# EAGLE design Keyboard40 (EAGLE 9.3.0)

## Sheet 1 of 2
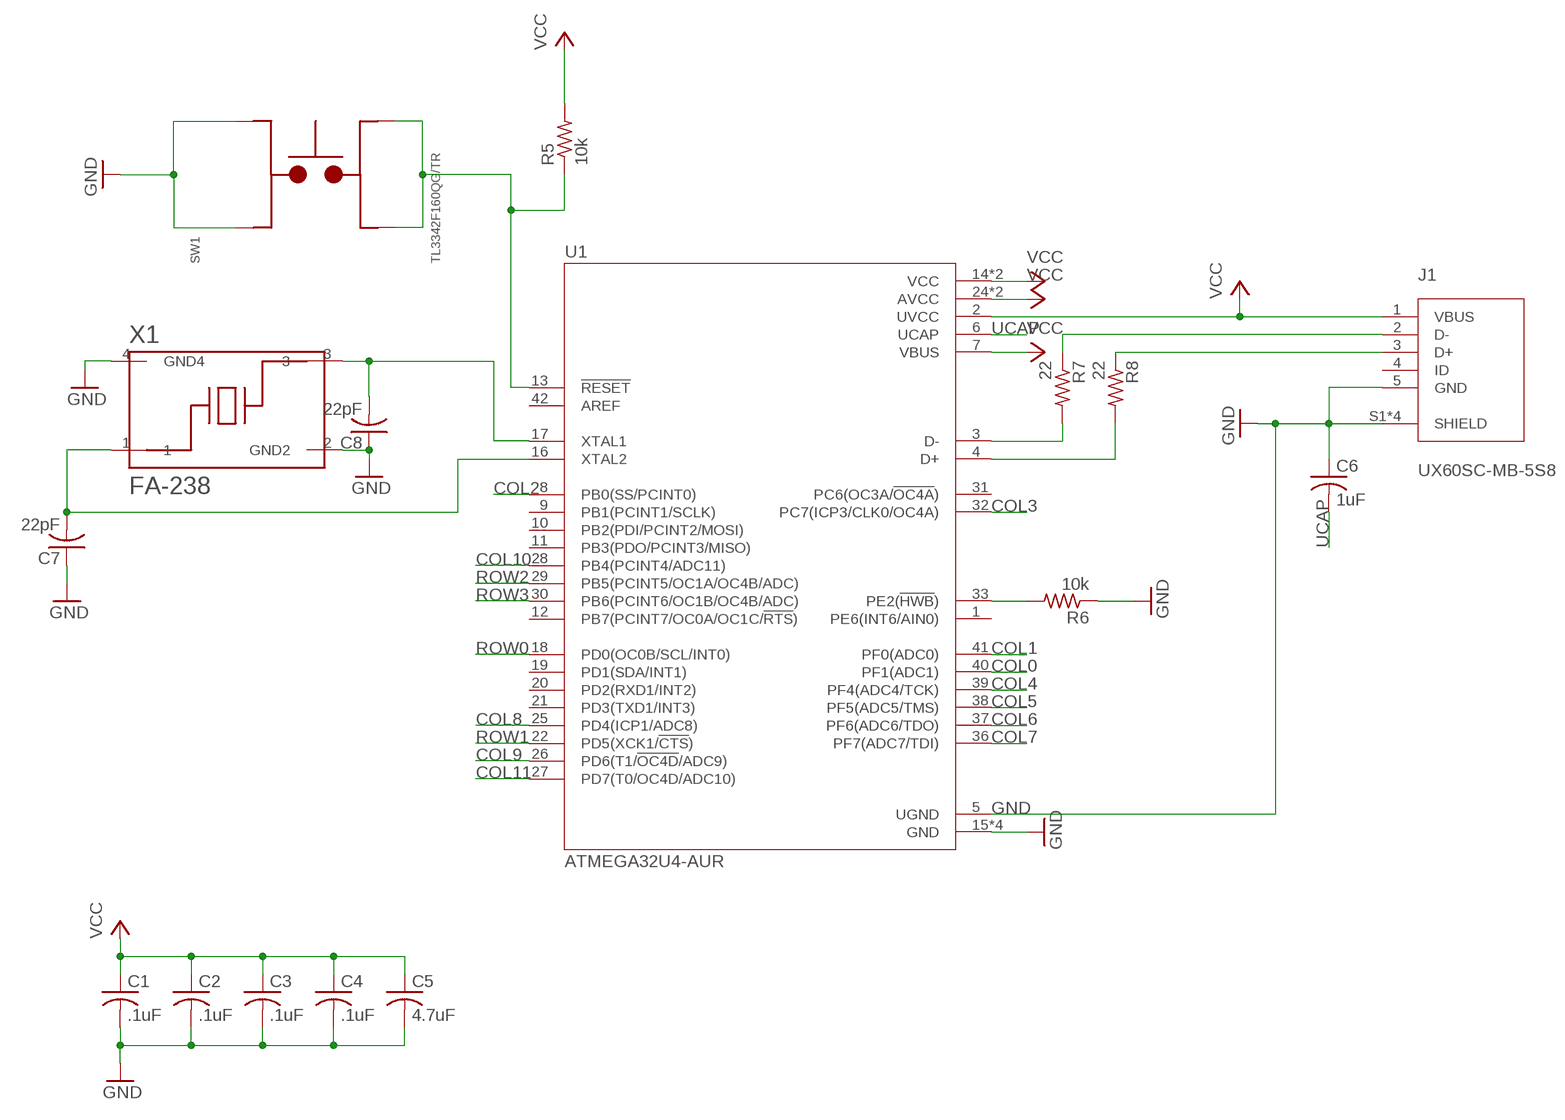
[diagram p0: schematic, sheet 1]

### Parts
C1  .1uF  C-USC0805  [C0805]
C2  .1uF  C-USC0805  [C0805]
C3  .1uF  C-USC0805  [C0805]
C4  .1uF  C-USC0805  [C0805]
C5  4.7uF  C-USC0805  [C0805]
C6  1uF  C-USC0805  [C0805]
C7  22pF  C-USC0805  [C0805]
C8  22pF  C-USC0805  [C0805]
J1  UX60SC-MB-5S8  [HIROSE_UX60SC-MB-5S8]
R5  10k  R-US_R0805  [R0805]
R6  10k  R-US_R0805  [R0805]
R7  22  R-US_R0805  [R0805]
R8  22  R-US_R0805  [R0805]
SW1  TL3342F160QG/TR  [SW_TL3342F160QG/TR]
U1  ATMEGA32U4-AUR  [QFP80P1200X1200X120-44N]
X1  FA-238  [OSCCC320X250X70-4N]

### Nets
COL0: U1.40(PF1(ADC1)) ; also sheet 2
COL1: U1.41(PF0(ADC0)) ; also sheet 2
COL2: U1.8(PB0(SS/PCINT0)) ; also sheet 2
COL3: U1.32(PC7(ICP3/CLK0/OC4A)) ; also sheet 2
COL4: U1.39(PF4(ADC4/TCK)) ; also sheet 2
COL5: U1.38(PF5(ADC5/TMS)) ; also sheet 2
COL6: U1.37(PF6(ADC6/TDO)) ; also sheet 2
COL7: U1.36(PF7(ADC7/TDI)) ; also sheet 2
COL8: U1.25(PD4(ICP1/ADC8)) ; also sheet 2
COL9: U1.26(PD6(T1/!OC4D!/ADC9)) ; also sheet 2
COL10: U1.28(PB4(PCINT4/ADC11)) ; also sheet 2
COL11: U1.27(PD7(T0/OC4D/ADC10)) ; also sheet 2
GND: C1.2 C2.2 C3.2 C4.2 C5.2 C6.1 C7.1 C8.1 J1.5(GND) J1.S1(SHIELD) J1.S2(SHIELD) J1.S3(SHIELD) J1.S4(SHIELD) R6.1 SW1.3 SW1.4 U1.5(UGND) U1.15(GND) U1.23(GND) U1.35(GND) U1.43(GND) X1.2(GND2) X1.4(GND4)
N$7: C8.2 U1.17(XTAL1) X1.3
N$8: C7.2 U1.16(XTAL2) X1.1
N$9: R5.1 SW1.1 SW1.2 U1.13(!RESET)
N$10: R6.2 U1.33(PE2(!HWB!))
N$14: R7.2 U1.3(D-)
N$15: J1.2(D-) R7.1
N$16: R8.2 U1.4(D+)
N$17: J1.3(D+) R8.1
ROW0: U1.18(PD0(OC0B/SCL/INT0)) ; also sheet 2
ROW1: U1.22(PD5(XCK1/!CTS!)) ; also sheet 2
ROW2: U1.29(PB5(PCINT5/OC1A/OC4B/ADC)) ; also sheet 2
ROW3: U1.30(PB6(PCINT6/OC1B/OC4B/ADC)) ; also sheet 2
UCAP: C6.2 U1.6(UCAP)
VCC: C1.1 C2.1 C3.1 C4.1 C5.1 J1.1(VBUS) R5.2 U1.2(UVCC) U1.7(VBUS) U1.14(VCC) U1.24(AVCC) U1.34(VCC) U1.44(AVCC)
Unconnected: J1.4(ID) U1.1(PE6(INT6/AIN0)) U1.9(PB1(PCINT1/SCLK)) U1.10(PB2(PDI/PCINT2/MOSI)) U1.11(PB3(PDO/PCINT3/MISO)) U1.12(PB7(PCINT7/OC0A/OC1C/!RTS!)) U1.19(PD1(SDA/INT1)) U1.20(PD2(RXD1/INT2)) U1.21(PD3(TXD1/INT3)) U1.31(PC6(OC3A/!OC4A!)) U1.42(AREF)

## Sheet 2 of 2
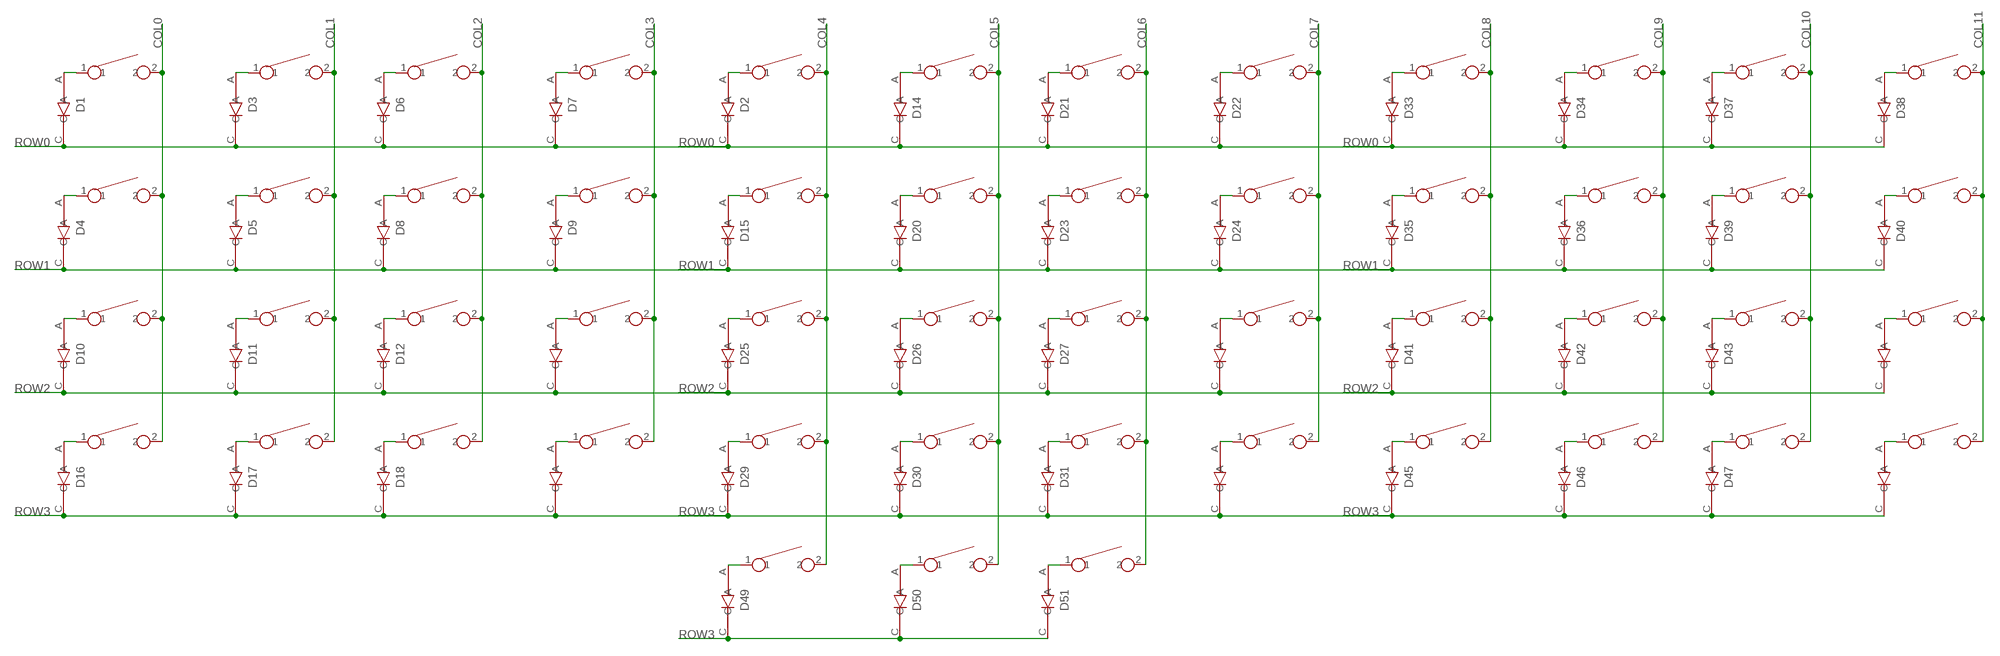
[diagram p1: schematic, sheet 2]

### Parts
D1  BAV21W-7-F  [SOD3715X135N]
D2  BAV21W-7-F  [SOD3715X135N]
D3  BAV21W-7-F  [SOD3715X135N]
D4  BAV21W-7-F  [SOD3715X135N]
D5  BAV21W-7-F  [SOD3715X135N]
D6  BAV21W-7-F  [SOD3715X135N]
D7  BAV21W-7-F  [SOD3715X135N]
D8  BAV21W-7-F  [SOD3715X135N]
D9  BAV21W-7-F  [SOD3715X135N]
D10  BAV21W-7-F  [SOD3715X135N]
D11  BAV21W-7-F  [SOD3715X135N]
D12  BAV21W-7-F  [SOD3715X135N]
D13  BAV21W-7-F  [SOD3715X135N]
D14  BAV21W-7-F  [SOD3715X135N]
D15  BAV21W-7-F  [SOD3715X135N]
D16  BAV21W-7-F  [SOD3715X135N]
D17  BAV21W-7-F  [SOD3715X135N]
D18  BAV21W-7-F  [SOD3715X135N]
D19  BAV21W-7-F  [SOD3715X135N]
D20  BAV21W-7-F  [SOD3715X135N]
D21  BAV21W-7-F  [SOD3715X135N]
D22  BAV21W-7-F  [SOD3715X135N]
D23  BAV21W-7-F  [SOD3715X135N]
D24  BAV21W-7-F  [SOD3715X135N]
D25  BAV21W-7-F  [SOD3715X135N]
D26  BAV21W-7-F  [SOD3715X135N]
D27  BAV21W-7-F  [SOD3715X135N]
D28  BAV21W-7-F  [SOD3715X135N]
D29  BAV21W-7-F  [SOD3715X135N]
D30  BAV21W-7-F  [SOD3715X135N]
D31  BAV21W-7-F  [SOD3715X135N]
D32  BAV21W-7-F  [SOD3715X135N]
D33  BAV21W-7-F  [SOD3715X135N]
D34  BAV21W-7-F  [SOD3715X135N]
D35  BAV21W-7-F  [SOD3715X135N]
D36  BAV21W-7-F  [SOD3715X135N]
D37  BAV21W-7-F  [SOD3715X135N]
D38  BAV21W-7-F  [SOD3715X135N]
D39  BAV21W-7-F  [SOD3715X135N]
D40  BAV21W-7-F  [SOD3715X135N]
D41  BAV21W-7-F  [SOD3715X135N]
D42  BAV21W-7-F  [SOD3715X135N]
D43  BAV21W-7-F  [SOD3715X135N]
D44  BAV21W-7-F  [SOD3715X135N]
D45  BAV21W-7-F  [SOD3715X135N]
D46  BAV21W-7-F  [SOD3715X135N]
D47  BAV21W-7-F  [SOD3715X135N]
D48  BAV21W-7-F  [SOD3715X135N]
D49  BAV21W-7-F  [SOD3715X135N]
D50  BAV21W-7-F  [SOD3715X135N]
D51  BAV21W-7-F  [SOD3715X135N]
U$1  CHERRY_MXCHERRY_MX_PLATE  [CHERRY_MX_PLATE]
U$2  CHERRY_MXCHERRY_MX_PLATE  [CHERRY_MX_PLATE]
U$3  CHERRY_MXCHERRY_MX_PLATE  [CHERRY_MX_PLATE]
U$4  CHERRY_MXCHERRY_MX_PLATE  [CHERRY_MX_PLATE]
U$5  CHERRY_MXCHERRY_MX_PLATE  [CHERRY_MX_PLATE]
U$6  CHERRY_MXCHERRY_MX_PLATE  [CHERRY_MX_PLATE]
U$7  CHERRY_MXCHERRY_MX_PLATE  [CHERRY_MX_PLATE]
U$8  CHERRY_MXCHERRY_MX_PLATE  [CHERRY_MX_PLATE]
U$9  CHERRY_MXCHERRY_MX_PLATE  [CHERRY_MX_PLATE]
U$10  CHERRY_MXCHERRY_MX_PLATE  [CHERRY_MX_PLATE]
U$11  CHERRY_MXCHERRY_MX_PLATE  [CHERRY_MX_PLATE]
U$12  CHERRY_MXCHERRY_MX_PLATE  [CHERRY_MX_PLATE]
U$13  CHERRY_MXCHERRY_MX_1_2_PLATE  [CHERRY_MX_1_2_PLATE]
U$14  CHERRY_MXCHERRY_MX_1_2_PLATE  [CHERRY_MX_1_2_PLATE]
U$15  CHERRY_MXCHERRY_MX_1_2_PLATE  [CHERRY_MX_1_2_PLATE]
U$16  CHERRY_MXCHERRY_MX_PLATE  [CHERRY_MX_PLATE]
U$17  CHERRY_MXCHERRY_MX_PLATE  [CHERRY_MX_PLATE]
U$18  CHERRY_MXCHERRY_MX_PLATE  [CHERRY_MX_PLATE]
U$19  CHERRY_MXCHERRY_MX_PLATE  [CHERRY_MX_PLATE]
U$20  CHERRY_MXCHERRY_MX_PLATE  [CHERRY_MX_PLATE]
U$21  CHERRY_MXCHERRY_MX_PLATE  [CHERRY_MX_PLATE]
U$22  CHERRY_MXCHERRY_MX_PLATE  [CHERRY_MX_PLATE]
U$23  CHERRY_MXCHERRY_MX_PLATE  [CHERRY_MX_PLATE]
U$24  CHERRY_MXCHERRY_MX_PLATE  [CHERRY_MX_PLATE]
U$25  CHERRY_MXCHERRY_MX_PLATE  [CHERRY_MX_PLATE]
U$26  CHERRY_MXCHERRY_MX_PLATE  [CHERRY_MX_PLATE]
U$27  CHERRY_MXCHERRY_MX_PLATE  [CHERRY_MX_PLATE]
U$28  CHERRY_MXCHERRY_MX_PLATE  [CHERRY_MX_PLATE]
U$29  CHERRY_MXCHERRY_MX_PLATE  [CHERRY_MX_PLATE]
U$30  CHERRY_MXCHERRY_MX_PLATE  [CHERRY_MX_PLATE]
U$31  CHERRY_MXCHERRY_MX_PLATE  [CHERRY_MX_PLATE]
U$32  CHERRY_MXCHERRY_MX_PLATE  [CHERRY_MX_PLATE]
U$33  CHERRY_MXCHERRY_MX_PLATE  [CHERRY_MX_PLATE]
U$34  CHERRY_MXCHERRY_MX_PLATE  [CHERRY_MX_PLATE]
U$35  CHERRY_MXCHERRY_MX_PLATE  [CHERRY_MX_PLATE]
U$36  CHERRY_MXCHERRY_MX_PLATE  [CHERRY_MX_PLATE]
U$37  CHERRY_MXCHERRY_MX_PLATE  [CHERRY_MX_PLATE]
U$38  CHERRY_MXCHERRY_MX_PLATE  [CHERRY_MX_PLATE]
U$39  CHERRY_MXCHERRY_MX_PLATE  [CHERRY_MX_PLATE]
U$40  CHERRY_MXCHERRY_MX_PLATE  [CHERRY_MX_PLATE]
U$41  CHERRY_MXCHERRY_MX_PLATE  [CHERRY_MX_PLATE]
U$42  CHERRY_MXCHERRY_MX_PLATE  [CHERRY_MX_PLATE]
U$43  CHERRY_MXCHERRY_MX_PLATE  [CHERRY_MX_PLATE]
U$44  CHERRY_MXCHERRY_MX_PLATE  [CHERRY_MX_PLATE]
U$45  CHERRY_MXCHERRY_MX_PLATE  [CHERRY_MX_PLATE]
U$46  CHERRY_MXCHERRY_MX_PLATE  [CHERRY_MX_PLATE]
U$47  CHERRY_MXCHERRY_MX_PLATE  [CHERRY_MX_PLATE]
U$48  CHERRY_MXCHERRY_MX_PLATE  [CHERRY_MX_PLATE]
U$49  CHERRY_MXCHERRY_MX_PLATE  [CHERRY_MX_PLATE]
U$50  CHERRY_MXCHERRY_MX_PLATE  [CHERRY_MX_PLATE]
U$51  CHERRY_MXCHERRY_MX_PLATE  [CHERRY_MX_PLATE]

### Nets
COL0: U$1.2 U$2.2 U$3.2 U$17.2 ; also sheet 1
COL1: U$4.2 U$5.2 U$6.2 U$18.2 ; also sheet 1
COL2: U$7.2 U$8.2 U$9.2 U$19.2 ; also sheet 1
COL3: U$10.2 U$11.2 U$12.2 U$16.2 ; also sheet 1
COL4: U$13.2 U$22.2 U$23.2 U$24.2 U$36.2 ; also sheet 1
COL5: U$14.2 U$25.2 U$26.2 U$27.2 U$37.2 ; also sheet 1
COL6: U$15.2 U$28.2 U$29.2 U$30.2 U$38.2 ; also sheet 1
COL7: U$20.2 U$21.2 U$31.2 U$35.2 ; also sheet 1
COL8: U$34.2 U$39.2 U$40.2 U$49.2 ; also sheet 1
COL9: U$41.2 U$42.2 U$43.2 U$50.2 ; also sheet 1
COL10: U$44.2 U$45.2 U$46.2 U$51.2 ; also sheet 1
COL11: U$32.2 U$33.2 U$47.2 U$48.2 ; also sheet 1
N$1: D9.A U$10.1
N$2: D5.A U$5.1
N$3: D7.A U$12.1
N$4: D20.A U$26.1
N$5: D14.A U$25.1
N$6: D3.A U$4.1
N$11: D11.A U$6.1
N$12: D13.A U$11.1
N$18: D16.A U$17.1
N$19: D19.A U$16.1
N$20: D49.A U$13.1
N$21: D17.A U$18.1
N$22: D24.A U$20.1
N$23: D22.A U$31.1
N$24: D26.A U$27.1
N$25: D28.A U$21.1
N$26: D25.A U$24.1
N$27: D2.A U$22.1
N$28: D15.A U$23.1
N$29: D21.A U$28.1
N$30: D23.A U$29.1
N$31: D27.A U$30.1
N$32: D36.A U$42.1
N$33: D6.A U$7.1
N$34: D32.A U$35.1
N$35: D8.A U$8.1
N$36: D12.A U$9.1
N$37: D10.A U$3.1
N$38: D1.A U$1.1
N$39: D4.A U$2.1
N$40: D30.A U$37.1
N$41: D31.A U$38.1
N$42: D29.A U$36.1
N$43: D34.A U$41.1
N$44: D40.A U$32.1
N$45: D38.A U$47.1
N$46: D42.A U$43.1
N$47: D44.A U$33.1
N$48: D41.A U$40.1
N$49: D33.A U$34.1
N$50: D35.A U$39.1
N$51: D37.A U$44.1
N$52: D39.A U$45.1
N$53: D43.A U$46.1
N$54: D48.A U$48.1
N$55: D47.A U$51.1
N$56: D45.A U$49.1
N$57: D46.A U$50.1
N$58: D18.A U$19.1
N$59: D50.A U$14.1
N$60: D51.A U$15.1
ROW0: D1.C D2.C D3.C D6.C D7.C D14.C D21.C D22.C D33.C D34.C D37.C D38.C ; also sheet 1
ROW1: D4.C D5.C D8.C D9.C D15.C D20.C D23.C D24.C D35.C D36.C D39.C D40.C ; also sheet 1
ROW2: D10.C D11.C D12.C D13.C D25.C D26.C D27.C D28.C D41.C D42.C D43.C D44.C ; also sheet 1
ROW3: D16.C D17.C D18.C D19.C D29.C D30.C D31.C D32.C D45.C D46.C D47.C D48.C D49.C D50.C D51.C ; also sheet 1

## Library data of the parts
C1-C8 = rcl:C-US: CAPACITOR, American symbol; SPICEPREFIX: C
D1-D51 = BAV21W-7-F:BAV21W-7-F: SURFACE MOUNT SWITCHING DIODE; DESCRIPTION: DIODE, SWITCH, 200V, 0.25W, SOD123; Diode Type: Switching; Forward Current If_AV_; DIGI-KEY_PART_NUMBER: BAV21W-FDICT-ND; DIGI-KEY_PURCHASE_URL: https://www.digikey.com/product-detail/en/diodes-incorporated/BAV21W-7-F/BAV21W-FDICT-ND/717830?utm_source=snapeda&utm_medium=aggregator&utm_campaign=symbol; MF: Diodes Inc.; MP: BAV21W-7-F; PACKAGE: SOD-123 Diodes Inc.
J1 = UX60SC-MB-5S8:UX60SC-MB-5S8: Conn Mini USB 2.0 Type B RCP 5 POS 0.8mm Solder RA SMD 5 Terminal 1 Port Embossed T/R; AVAILABILITY: Unavailable; DESCRIPTION: Conn Mini USB 2.0 Type B RCP 5 POS 0.8mm Solder RA SMD 5 Terminal 1 Port Embossed T/R; MF: Hirose; MP: UX60SC-MB-5S8; PACKAGE: None; PRICE: None
R5-R8 = rcl:R-US_: RESISTOR, American symbol; SPICEPREFIX: R
SW1 = TL3342F160QG_TR:TL3342F160QG/TR: TL3342 Series SPST 1.6 N Round Button Gull Wing Surface Mount Tactile Switch; AVAILABILITY: Unavailable; DESCRIPTION: Switch Tactile Spst-No 0.05a 12v; MF: E-Switch; MP: TL3342F160QG/TR; PACKAGE: FakePackage u; PRICE: None
U1 = ATMEGA32U4-AUR:ATMEGA32U4-AUR: ATmega Series 16 MHz 32 KB Flash 2.5 KB SRAM 8-Bit Microcontroller - TQFP-44; AVAILABILITY: Unavailable; DESCRIPTION: ATmega Series 16 MHz 32 KB Flash 2.5 KB SRAM 8-Bit Microcontroller - TQFP-44; MF: Microchip; MP: ATMEGA32U4-AUR; PACKAGE: TQFP-44 Microchip; PRICE: None
U$1-U$51 = CHERRY_MX:CHERRY_MX
X1 = FA-238:FA-238: Crystal 24.0000mhz 18pf Smd; AVAILABILITY: Unavailable; MF: EPSON; MP: FA-238; PACKAGE: SMD-4 Epson; PRICE: None

## Net classes
0 default: width 0.203 mm

## Board
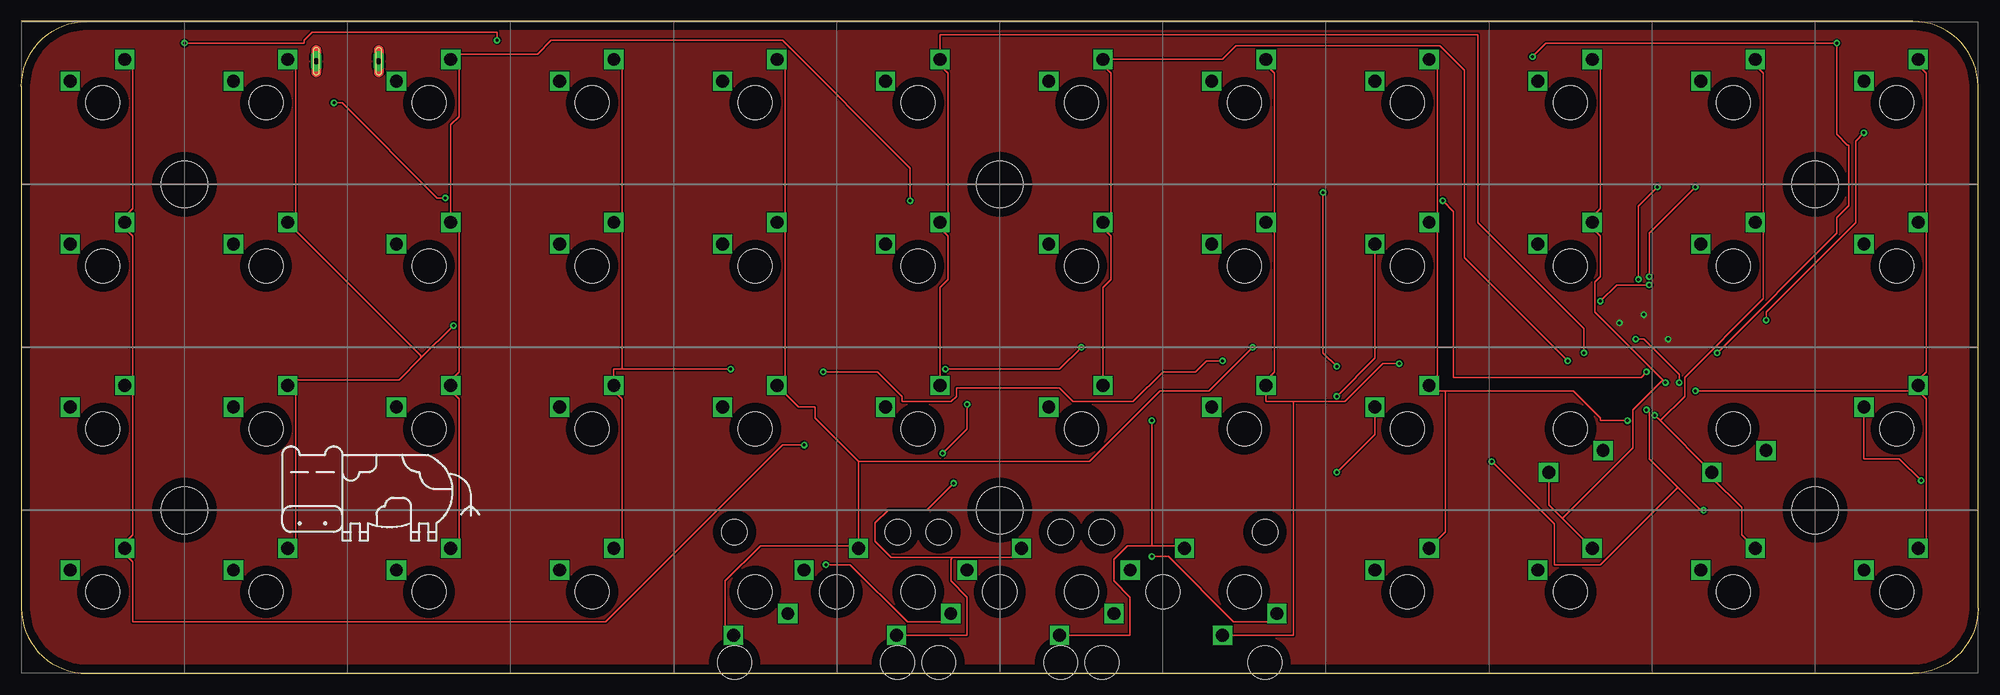
[diagram p2: board, top side]
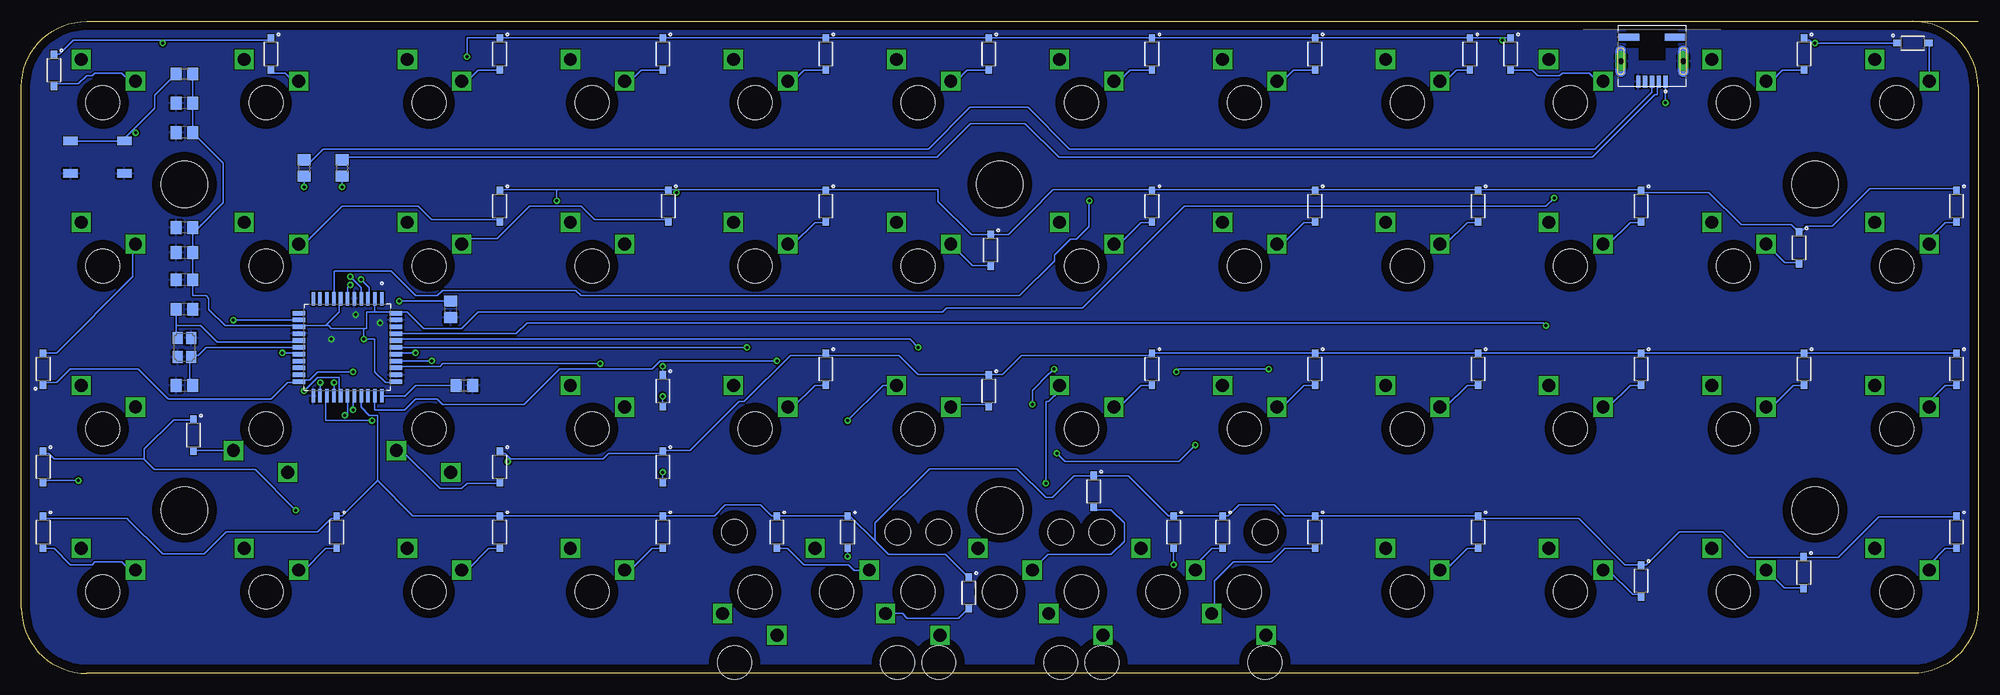
[diagram p3: board, bottom side, seen from below]

Size 228.6 x 76.2 mm. Coordinates in mm from the lower left corner, seen from the top.
Outline: 7.62,76.2 220.98,76.2 arc-90 228.6,68.58 228.6,7.62 arc-90 220.98,0 7.62,0 arc-90 0,7.62 0,68.58 arc-90 7.62,76.2
Outline: 7.62,76.2 0,76.2
Copper layers (1*16): Top 0.035mm / dielectric 1.5mm / Bottom 0.035mm
Design rules "default": minimum track width 6mil, minimum drill 0.35mm, track to track 6mil, track to pad 6mil, pad to pad 6mil, via to via 6mil, smd to smd 6mil, copper to edge 40mil, drill to drill 6mil, minimum pad ring 10mil, minimum via ring 8mil, stop-mask expansion 4mil, vias tented up to drill 0mil, thermal gap 10mil
Holes 5.5 mm at 19.05,57.15 19.05,19.05 114.3,57.15 114.3,19.05 209.55,19.05 209.55,57.15

### Footprints (pad centres in the part's own frame; a part is rotated, then mirrored left to right if it is on the bottom)
C0805 = smd 1.3 x 1.5: 1 -0.95,0; 2 0.95,0
SOD3715X135N = smd 1 x 0.75: A 1.8,0; C -1.8,0
HIROSE_UX60SC-MB-5S8 = smd 0.5 x 1.4: 1 -1.6,6.1; 2 -0.8,6.1; 3 0,6.1; 4 0.8,6.1; 5 1.6,6.1 | drill 0.7 pad 1.1 long: S1 -3.65,3.7; S2 3.65,3.7 | smd 2.35 x 0.8: S3 -2.675,0.9; S4 2.675,0.9
R0805 = smd 1.3 x 1.5: 1 -0.95,0; 2 0.95,0
SW_TL3342F160QG/TR = smd 1.7 x 1: 1 -3.15,-1.9; 2 3.15,-1.9; 3 -3.15,1.9; 4 3.15,1.9
QFP80P1200X1200X120-44N = smd 1.6 x 0.55: 1 -5.68,4; 2 -5.68,3.2; 3 -5.68,2.4; 4 -5.68,1.6; 5 -5.68,0.8; 6 -5.68,0; 7 -5.68,-0.8; 8 -5.68,-1.6; 9 -5.68,-2.4; 10 -5.68,-3.2; 11 -5.68,-4; 23 5.68,-4; 24 5.68,-3.2; 25 5.68,-2.4; 26 5.68,-1.6; 27 5.68,-0.8; 28 5.68,0; 29 5.68,0.8; 30 5.68,1.6; 31 5.68,2.4; 32 5.68,3.2; 33 5.68,4 | smd 0.55 x 1.6: 12 -4,-5.68; 13 -3.2,-5.68; 14 -2.4,-5.68; 15 -1.6,-5.68; 16 -0.8,-5.68; 17 0,-5.68; 18 0.8,-5.68; 19 1.6,-5.68; 20 2.4,-5.68; 21 3.2,-5.68; 22 4,-5.68; 34 4,5.68; 35 3.2,5.68; 36 2.4,5.68; 37 1.6,5.68; 38 0.8,5.68; 39 0,5.68; 40 -0.8,5.68; 41 -1.6,5.68; 42 -2.4,5.68; 43 -3.2,5.68; 44 -4,5.68
CHERRY_MX_PLATE = drill 1.499 square: 1 -3.81,2.54; 2 2.54,5.08 | hole 3.988: 0,0
CHERRY_MX_1_2_PLATE = drill 1.5 square: 1 -3.81,2.54; 2 2.54,5.08 | hole 4: 0,0 | hole 3: -11.938,6.985; 11.938,6.985 | hole 3.95: -11.938,-8.255; 11.938,-8.255
OSCCC320X250X70-4N = smd 1.4 x 1.2: 1 -1.1,-0.8; 2 1.1,-0.8; 3 1.1,0.8; 4 -1.1,0.8

### Placement (x,y rotation side)
C1  209.55,45.99 180 bottom
C2  209.55,49.16 180 bottom
C3  209.55,52.09 180 bottom
C4  209.55,63.21 180 bottom
C5  209.55,66.64 180 bottom
C6  178.44,42.55 90 bottom
C7  209.55,42.55 180 bottom
C8  209.55,33.66 0 bottom
D1  7.62,73.66 0 bottom
D2  77.47,72.39 270 bottom
D3  20.32,72.39 270 bottom
D4  2.54,54.61 270 bottom
D5  20.91,49.73 270 bottom
D6  54.61,72.39 270 bottom
D7  59.37,72.39 270 bottom
D8  39.37,54.61 270 bottom
D9  58.42,54.61 270 bottom
D10  2.54,35.56 270 bottom
D11  20.32,35.56 270 bottom
D12  39.37,35.56 270 bottom
D13  58.42,35.56 270 bottom
D14  96.52,72.39 270 bottom
D15  77.47,54.61 270 bottom
D16  2.54,16.51 270 bottom
D17  20.37,11.77 270 bottom
D18  39.37,10.79 270 bottom
D19  58.42,16.51 270 bottom
D20  96.52,54.61 270 bottom
D21  115.57,72.39 270 bottom
D22  134.62,72.39 270 bottom
D23  115.37,49.46 270 bottom
D24  134.62,54.61 270 bottom
D25  77.47,35.56 270 bottom
D26  96.52,35.56 270 bottom
D27  115.57,33.02 270 bottom
D28  134.62,35.56 270 bottom
D29  77.47,16.51 270 bottom
D30  93.98,16.51 270 bottom
D31  117.93,9.41 270 bottom
D32  132.08,16.51 270 bottom
D33  153.67,72.39 270 bottom
D34  172.72,72.39 270 bottom
D35  153.67,33.02 270 bottom
D36  153.03,54.61 270 bottom
D37  199.44,72.39 270 bottom
D38  224.79,70.48 270 bottom
D39  172.72,54.61 270 bottom
D40  226.06,35.56 90 bottom
D41  153.67,24.13 270 bottom
D42  172.72,24.13 270 bottom
D43  208.5,27.83 270 bottom
D44  226.06,24.13 270 bottom
D45  153.67,16.51 270 bottom
D46  172.72,16.51 270 bottom
D47  191.77,16.51 270 bottom
D48  226.06,16.51 270 bottom
D49  88.27,16.51 270 bottom
D50  103.31,21.27 270 bottom
D51  140.34,16.51 270 bottom
J1  38.1,75.25 180 bottom
R5  209.55,70.06 0 bottom
R6  176.85,33.66 180 bottom
R7  191.13,59.05 270 bottom
R8  195.58,59.05 270 bottom
SW1  219.71,60.33 180 bottom
U1  190.5,38.1 270 bottom
U$1  9.53,66.67 0 top
U$2  9.53,47.62 0 top
U$3  9.53,28.57 0 top
U$4  28.57,66.67 0 top
U$5  28.57,47.62 0 top
U$6  28.57,28.57 0 top
U$7  47.62,66.67 0 top
U$8  47.62,47.62 0 top
U$9  47.62,28.57 0 top
U$10  66.67,47.62 0 top
U$11  66.67,28.57 0 top
U$12  66.67,66.67 0 top
U$13  95.25,9.53 0 top
U$14  114.3,9.53 0 top
U$15  133.35,9.53 0 top
U$16  66.67,9.53 0 top
U$17  9.53,9.53 0 top
U$18  28.57,9.53 0 top
U$19  47.62,9.53 0 top
U$20  142.88,47.62 0 top
U$21  142.88,28.57 0 top
U$22  85.72,66.67 0 top
U$23  85.72,47.62 0 top
U$24  85.72,28.57 0 top
U$25  104.78,66.67 0 top
U$26  104.78,47.62 0 top
U$27  104.78,28.57 0 top
U$28  123.83,66.67 0 top
U$29  123.83,47.62 0 top
U$30  123.83,28.57 0 top
U$31  142.88,66.67 0 top
U$32  219.07,47.62 0 top
U$33  219.07,28.57 0 top
U$34  161.93,66.67 0 top
U$35  142.88,9.53 180 top
U$36  85.72,9.53 180 top
U$37  104.78,9.53 180 top
U$38  123.83,9.53 180 top
U$39  161.93,47.62 0 top
U$40  161.93,28.57 0 top
U$41  180.97,66.67 0 top
U$42  180.97,47.62 0 top
U$43  180.97,28.57 180 top
U$44  200.03,66.67 0 top
U$45  200.03,47.62 0 top
U$46  200.03,28.57 180 top
U$47  219.07,66.67 0 top
U$48  219.07,9.53 0 top
U$49  161.93,9.53 0 top
U$50  180.97,9.53 0 top
U$51  200.03,9.53 0 top
X1  209.55,38.1 270 bottom

### Tracks (layer width: path | path; a pad name or v marks a point on that pad's centre or on a via)
COL0  (via drill 0.35)
  Top 0.203: U$1.2 13.02,70.8 13.02,54.29 12.06,53.34 U$2.2 12.06,52.07 13.02,51.12 13.02,34.61 U$3.2 13.02,32.7 13.02,16.19 12.06,15.24 U$17.2 12.06,13.97 13.02,13.02 13.02,6.03 68.26,6.03 88.9,26.67 v91.44,26.67 | v123.83,38.1 121.28,35.56 v107.95,35.56 | v107.63,25.72 110.49,28.57 v110.49,31.43
  Bottom 0.203: U1.40 184.67,39.05 124.78,39.05 v123.83,38.1 | v91.44,26.67 93.34,24.77 106.68,24.77 v107.63,25.72 | v107.95,35.56 108.48,35.03 108.54,35.03 110.49,33.09 v110.49,31.43
COL1  (via drill 0.35)
  Top 0.203: 46.67,36.83 44.13,34.29 32.07,34.29 | 46.67,36.83 v50.48,40.64 | 32.07,34.29 31.11,34.29 U$6.2 32.07,34.29 | U$18.2 32.07,15.56 32.07,34.29 | 32.07,51.75 46.67,37.15 46.67,36.83 | U$4.2 32.07,70.8 32.07,51.75 | 32.07,51.75 U$5.2
  Bottom 0.203: U1.41 170.8,39.7 169.54,40.96 50.8,40.96 v50.48,40.64
COL2  (via drill 0.35)
  Top 0.203: U$19.2 51.12,15.56 51.12,32.07 50.16,33.02 U$9.2 50.16,34.29 51.12,35.24 51.12,51.75 U$8.2 50.16,64.14 51.12,65.09 51.12,70.8 U$7.2 50.8,72.39 60.33,72.39 61.91,73.98 88.9,73.98 103.82,59.05 v103.82,55.24
  Bottom 0.203: U1.8 192.09,43.81 192.09,46.99 185.42,46.99 182.56,44.13 180.02,44.13 179.39,44.77 163.83,44.77 163.19,44.13 111.97,44.13 107.89,48.21 107.89,48.91 106.06,50.74 105.36,50.74 103.89,52.2 103.89,55.17 v103.82,55.24
COL3  (via drill 0.35)
  Top 0.203: v140.34,36.51 138.43,36.51 137.16,35.24 133.35,35.24 129.86,31.75 122.87,31.75 121.28,33.34 109.22,33.34 109.22,32.38 108.58,31.75 102.87,31.75 102.87,32.38 100.01,35.24 v93.66,35.24 | 70.17,35.56 69.22,35.56 U$11.2 69.22,33.02 70.17,32.07 70.17,15.56 U$16.2 | 70.17,35.56 v82.87,35.56 | 70.17,35.56 70.17,51.75 | U$12.2 70.17,70.8 70.17,51.75 | 70.17,51.75 U$10.2
  Bottom 0.203: v140.34,36.51 153.99,36.51 154.94,35.56 165.74,35.56 169.86,31.43 179.39,31.43 180.02,32.07 182.56,32.07 183.83,30.8 187.32,30.8 187.32,32.38 U1.32 | v93.66,35.24 93.34,35.56 v82.87,35.56
COL4  (via drill 0.35)
  Top 0.203: v143.83,38.1 138.75,33.02 133.03,33.02 124.78,24.77 97.79,24.77 | 97.79,14.92 97.79,24.77 | U$36.2 82.23,5.4 82.23,10.79 86.36,14.92 97.79,14.92 | 97.79,14.92 U$13.2 | 89.22,32.7 90.81,31.11 92.71,31.11 92.71,29.84 97.79,24.77 | 89.22,32.7 89.22,51.75 | 89.22,32.7 U$24.2 | U$22.2 89.22,70.8 89.22,51.75 | 89.22,51.75 U$23.2
  Bottom 0.203: v143.83,38.1 U1.39
COL5  (via drill 0.35)
  Top 0.203: U$37.2 110.49,4.45 110.49,8.89 108.58,10.79 108.58,13.34 108.81,13.56 | U$14.2 115.8,13.56 108.81,13.56 | U$27.2 107.31,45.09 108.27,46.04 108.27,51.12 107.31,52.07 U$26.2 108.27,53.66 108.27,70.17 107.31,71.12 U$25.2 107.31,74.61 170.18,74.61 170.18,52.7 182.56,40.32 v182.56,37.47 | v108.9,22.23 105.81,19.13 101.28,19.13 99.74,17.59 99.74,15.43 101.61,13.56 108.81,13.56
  Bottom 0.203: v182.56,37.47 184.78,37.47 U1.38 | v108.9,22.23 108.9,31.75 108.58,31.75 107.31,33.02 U$27.2
COL6  (via drill 0.35)
  Top 0.203: U$38.2 129.54,4.45 129.54,8.89 127.64,10.79 127.64,13.34 129.22,14.92 132.08,14.92 | 132.08,14.92 135.89,14.92 U$15.2 | U$30.2 126.36,45.09 127.32,46.04 127.32,51.12 126.36,52.07 U$29.2 127.32,53.66 127.32,70.17 126.36,71.12 U$28.2 140.34,71.75 141.92,73.34 165.74,73.34 168.59,70.48 168.59,48.58 v180.66,36.51 | v132.08,29.53 132.08,14.92
  Bottom 0.203: v180.66,36.51 184.78,36.51 U1.37 | v132.08,29.53 127.95,33.66 U$30.2
COL7  (via drill 0.35)
  Top 0.203: U$31.2 145.41,71.12 146.37,70.17 146.37,53.66 U$20.2 146.37,51.75 146.37,35.24 145.41,34.29 U$21.2 145.41,31.75 148.59,31.75 | v160.97,36.2 159.07,36.2 154.62,31.75 148.59,31.75 | U$35.2 148.59,4.45 148.59,31.75
  Bottom 0.203: v160.97,36.2 179.39,36.2 179.71,35.88 184.78,35.88 U1.36
COL8  (via drill 0.35)
  Top 0.203: v187.64,29.53 184.47,29.53 184.47,29.84 181.29,33.02 166.37,33.02 | 165.42,33.02 164.47,33.02 U$40.2 165.42,33.02 | 165.42,33.02 166.37,33.02 | U$49.2 166.37,16.51 166.37,33.02 | 165.42,33.02 165.42,51.75 | U$34.2 165.42,70.8 165.42,51.75 | 165.42,51.75 U$39.2
  Bottom 0.203: v187.64,29.53 193.04,29.53 193.04,32.38 U1.25
COL9  (via drill 0.35)
  Top 0.203: 180.02,18.1 178.44,19.68 U$43.2 | 180.02,18.1 U$50.2 | 191.77,34.29 183.83,42.23 183.83,45.72 184.47,46.35 184.47,51.12 183.51,52.07 U$42.2 183.51,53.34 184.47,54.29 184.47,70.8 U$41.2 | 191.77,34.29 v192.09,33.97 | 180.02,18.1 188.28,26.35 188.28,30.8 191.77,34.29
  Bottom 0.203: v192.09,33.97 192.09,32.7 U1.26
COL10  (via drill 0.35)
  Top 0.203: U$44.2 202.56,71.12 203.52,70.17 203.52,53.66 U$45.2 203.52,51.75 203.52,43.81 194.31,34.61 194.31,32.38 191.45,29.53 | 191.45,29.53 U$46.2 197.49,22.86 200.98,19.37 200.98,16.19 U$51.2 | 191.45,29.53 v190.82,30.16
  Bottom 0.203: U1.28 190.5,30.16 v190.82,30.16
COL11  (via drill 0.35)
  Top 0.203: U$47.2 221.62,71.12 222.57,70.17 222.57,53.66 U$32.2 222.57,51.75 222.57,35.24 221.62,34.29 U$33.2 221.62,33.02 | 221.62,33.02 v195.58,33.02 | U$48.2 222.57,15.56 222.57,32.07 221.62,33.02
  Bottom 0.203: v195.58,33.02 193.99,34.61 191.45,34.61 191.45,32.7 U1.27
GND  (via drill 0.35)
  other vias: 189.55,41.91 186.69,40.96 192.41,39.05
  pour Bottom: -2.54,80.01 -2.54,-2.54 231.78,-2.54 231.78,80.01
  pour Top: -7.62,82.55 -7.62,-6.35 236.22,-6.35 236.22,82.55
N$1
  Bottom 0.203: U$10.1 62.23,50.16 59.69,52.7 58.42,52.7 D9.A
N$2
  Bottom 0.203: U$5.1 22.6,48 20.91,48 D5.A
N$3
  Bottom 0.203: U$12.1 62.23,69.22 60.96,70.48 59.37,70.48 D7.A
N$4
  Bottom 0.203: U$26.1 100.33,50.16 97.79,52.7 96.52,52.7 D20.A
N$5
  Bottom 0.203: U$25.1 100.33,69.22 99.06,70.48 96.52,70.48 D14.A
N$6
  Bottom 0.203: U$4.1 24.13,69.22 22.86,70.48 20.32,70.48 D3.A
N$7
  Bottom 0.203: C8.2 208.91,33.66 208.91,36.83 X1.3 208.6,37.15 207.96,37.15 207.01,38.1 U1.17
N$8
  Bottom 0.203: 210.5,40.64 C7.2 | 210.5,40.64 210.5,39.37 X1.1 | 210.5,40.64 207.65,40.64 205.74,38.73 202.88,38.73 196.22,38.73 U1.16
N$9  (via drill 0.35)
  Top 0.203: v203.84,41.27 203.84,42.23 214.31,52.7 214.31,62.23 v215.26,63.18
  Bottom 0.203: 215.58,63.5 213,66.08 213,67.56 R5.1 | 216.85,62.23 215.58,63.5 | v203.84,41.27 203.81,41.3 U1.13 | 215.58,63.5 v215.26,63.18 | 216.85,62.23 222.57,62.23 SW1.2 | 216.85,62.23 SW1.1
N$10
  Bottom 0.203: U1.33 183.87,32.42 183.83,32.38 182.56,33.66 R6.2
N$11
  Bottom 0.203: U$6.1 24.13,31.11 21.59,33.66 20.32,33.66 D11.A
N$12
  Bottom 0.203: U$11.1 62.23,31.11 59.69,33.66 58.42,33.66 D13.A
N$14  (via drill 0.35)
  Top 0.203: v191.13,56.83 188.91,54.61 v188.91,46.04
  Bottom 0.203: v191.13,56.83 R7.2 | v188.91,46.04 187.96,45.09 187.96,43.81 U1.3
N$15
  Bottom 0.203: J1.2 37.47,68.9 37.47,67.63 37.78,67.63 45.09,60.33 107.4,60.33 111.33,64.25 117.72,64.25 121.65,60.33 190.82,60.33 R7.1
N$16  (via drill 0.35)
  Top 0.203: v195.58,56.83 190.18,51.44 v190.18,46.35
  Bottom 0.203: v195.58,56.83 R8.2 | v190.18,46.35 188.91,45.09 188.91,43.81 U1.4
N$17
  Bottom 0.203: J1.3 38.1,67.94 44.77,61.28 106.15,61.28 111.02,66.15 117.78,66.15 122.65,61.28 193.36,61.28 194.94,59.69 195.58,59.69 R8.1
N$18
  Bottom 0.203: U$17.1 5.71,12.7 3.81,14.61 2.54,14.61 D16.A
N$19
  Bottom 0.203: U$16.1 62.23,12.06 59.69,14.61 58.42,14.61 D19.A
N$20
  Bottom 0.203: U$13.1 91.44,12.7 89.53,14.61 88.27,14.61 D49.A
N$21
  Bottom 0.203: D17.A 22.67,9.97 U$18.1
N$22
  Bottom 0.203: U$20.1 138.43,50.16 135.89,52.7 134.62,52.7 D24.A
N$23
  Bottom 0.203: U$31.1 138.43,69.22 137.16,70.48 134.62,70.48 D22.A
N$24
  Bottom 0.203: U$27.1 100.33,31.11 97.79,33.66 96.52,33.66 D26.A
N$25
  Bottom 0.203: U$21.1 138.43,31.11 135.89,33.66 134.62,33.66 D28.A
N$26
  Bottom 0.203: U$24.1 81.28,31.11 78.74,33.66 77.47,33.66 D25.A
N$27
  Bottom 0.203: U$22.1 81.28,69.22 80.01,70.48 77.47,70.48 D2.A
N$28
  Bottom 0.203: U$23.1 81.28,50.16 78.74,52.7 77.47,52.7 D15.A
N$29
  Bottom 0.203: U$28.1 119.38,69.22 118.11,70.48 115.57,70.48 D21.A
N$30
  Bottom 0.203: D23.A 117.51,47.66 U$29.1
N$31
  Bottom 0.203: U$30.1 119.7,31.43 115.57,31.43 D27.A
N$32
  Bottom 0.203: U$42.1 176.53,50.8 173.04,50.8 169.23,54.61 163.19,54.61 161.61,53.02 153.25,53.02 D36.A
N$33
  Bottom 0.203: U$7.1 44.45,69.22 45.4,70.17 48.58,70.17 48.9,69.85 51.44,69.85 52.07,70.48 54.61,70.48 D6.A
N$34  (via drill 0.35)
  Top 0.203: v132.08,13.65 133.99,13.65 141.6,6.03 146.69,6.03 U$35.1
  Bottom 0.203: D32.A v132.08,13.65
N$35
  Bottom 0.203: U$8.1 43.18,50.16 40.64,52.7 39.37,52.7 D8.A
N$36
  Bottom 0.203: U$9.1 43.18,31.11 40.64,33.66 39.37,33.66 D12.A
N$37
  Bottom 0.203: U$3.1 5.71,31.75 3.81,33.66 2.54,33.66 D10.A
N$38
  Bottom 0.203: U$1.1 5.71,73.66 D1.A
N$39
  Bottom 0.203: U$2.1 5.71,50.8 3.81,52.7 2.54,52.7 D4.A
N$40  (via drill 0.35)
  Top 0.203: v93.98,12.7 96.84,12.7 103.5,6.03 108.58,6.03 U$37.1
  Bottom 0.203: v93.98,12.7 D30.A
N$41
  Bottom 0.203: U$38.1 125.69,6.99 125.11,6.41 119.13,6.41 D31.A
N$42
  Bottom 0.203: U$36.1 89.22,6.99 89.22,10.79 87,13.02 82.55,13.02 80.96,14.61 77.47,14.61 D29.A
N$43
  Bottom 0.203: U$41.1 176.53,69.22 175.26,70.48 172.72,70.48 D34.A
N$44
  Bottom 0.203: U$32.1 215.58,50.16 215.58,46.35 224.47,37.47 226.06,37.47 D40.A
N$45
  Bottom 0.203: U$47.1 215.9,69.22 216.85,70.17 220.03,70.17 220.34,69.85 220.98,69.85 221.93,68.9 224.79,68.9 D38.A
N$46
  Bottom 0.203: U$43.1 184.15,26.04 179.71,21.59 177.16,21.59 176.53,22.23 172.72,22.23 D42.A
N$47  (via drill 0.35)
  Top 0.203: v221.93,22.54 219.39,25.08 215.26,25.08 U$33.1
  Bottom 0.203: v221.93,22.54 226.06,22.54 D44.A
N$48  (via drill 0.35)
  Top 0.203: v153.67,23.5 158.12,27.94 U$40.1
  Bottom 0.203: v153.67,23.5 D41.A
N$49
  Bottom 0.203: U$34.1 157.48,69.22 156.21,70.48 153.67,70.48 D33.A
N$50  (via drill 0.35)
  Top 0.203: v153.67,32.38 158.12,36.83 U$39.1
  Bottom 0.203: v153.67,32.38 D35.A
N$51
  Bottom 0.203: U$44.1 196.85,69.22 197.8,70.17 199.44,70.17 D37.A
N$52
  Bottom 0.203: U$45.1 195.58,50.16 191.13,54.61 182.25,54.61 180.66,53.02 172.72,53.02 D39.A
N$53
  Bottom 0.203: U$46.1 D43.A
N$54
  Bottom 0.203: U$48.1 215.9,12.06 216.85,13.02 219.45,13.02 220.03,13.02 220.34,12.7 222.88,12.7 224.79,14.61 226.06,14.61 D48.A
N$55
  Bottom 0.203: U$51.1 195.58,12.06 193.04,14.61 191.77,14.61 D47.A
N$56
  Bottom 0.203: U$49.1 157.48,12.06 154.94,14.61 153.67,14.61 D45.A
N$57
  Bottom 0.203: U$50.1 176.53,12.06 173.99,14.61 172.72,14.61 D46.A
N$58
  Bottom 0.203: U$19.1 43.18,12.06 40.32,9.21 39.37,9.21 D18.A
N$59
  Bottom 0.203: D50.A 103.31,19.25 103.18,19.13 101.28,19.13 99.74,17.59 99.74,15.43 101.28,13.89 108.66,13.89 U$14.1
N$60
  Bottom 0.203: U$15.1 131.33,12.06 131.97,12.7 137.16,12.7 139.06,14.61 140.34,14.61 D51.A
ROW0  (via drill 0.35)
  Top 0.203: v198.12,37.47 212.09,51.44 212.09,53.25 213.5,54.66 213.5,61.75 213.34,61.75 212.09,63 v212.09,73.66 178.12,73.66 v176.53,72.07 | v19.05,73.66 33.02,73.66 33.02,73.98 33.97,74.93 55.56,74.93 v55.56,73.98
  Bottom 0.203: 212.09,73.98 199.44,73.98 D37.C | 212.09,73.98 222.57,73.98 224.16,72.39 224.79,72.39 D38.C | v198.12,37.47 196.22,37.47 U1.18 | 212.09,73.98 v212.09,73.66 | D1.C v19.05,73.66 19.37,73.66 19.68,73.98 20.32,73.98 D3.C | 59.37,74.3 55.56,74.3 | 55.56,74.3 54.61,74.3 D6.C | 59.37,74.3 77.47,74.3 | 59.37,74.3 D7.C | 77.47,74.3 96.52,74.3 | 77.47,74.3 D2.C | 96.52,74.3 115.57,74.3 | 96.52,74.3 D14.C | 115.57,74.3 134.62,74.3 | 115.57,74.3 D21.C | 134.62,74.3 153.67,74.3 | 134.62,74.3 D22.C | 153.67,74.3 172.72,74.3 | 172.72,74.3 176.53,74.3 v176.53,72.07 | 172.72,74.3 D34.C | 153.67,74.3 D33.C | 55.56,74.3 v55.56,73.98
ROW1  (via drill 0.35)
  Top 0.203: v153.67,35.88 152.08,37.47 v152.08,56.2 | v189.87,35.24 189.23,34.61 167.32,34.61 167.32,53.98 v166.05,55.24
  Bottom 0.203: D40.C 226.06,33.97 224.47,33.97 222.88,35.56 214.95,35.56 211.46,32.07 199.39,32.07 197.49,33.97 196.22,33.97 U1.22 195.9,34.29 194.94,34.29 193.99,35.24 v189.87,35.24 | 153.03,56.52 152.08,56.52 | 152.08,56.52 134.62,56.52 | v153.67,35.88 D35.C | 152.08,56.52 v152.08,56.2 | 153.03,56.52 166.05,56.52 | 166.05,56.52 172.72,56.52 D39.C | 153.03,56.52 D36.C | 166.05,56.52 v166.05,55.24 | 58.42,56.52 39.37,56.52 D8.C 39.37,56.2 31.43,56.2 27.68,52.44 21.81,52.44 D5.C 20.75,51.53 20,52.28 | 58.42,56.52 77.47,56.52 | 58.42,56.52 D9.C | 77.47,56.52 96.52,56.52 | 77.47,56.52 D15.C | 96.52,56.52 D20.C | 96.52,56.52 108.1,56.52 109.43,55.18 109.43,55.13 113.31,51.26 D23.C 117.61,51.26 121.5,55.15 121.5,56.52 134.62,56.52 | 134.62,56.52 D24.C | 20.16,52.28 20,52.28 | 20,52.28 17.03,52.28 12.67,56.65 2.78,56.65 D4.C
ROW2  (via drill 0.35)
  Top 0.203: v189.87,30.8 190.18,30.48 190.18,25.08 193.52,21.75 | v196.53,19.05 196.22,19.05 193.52,21.75 | 193.52,21.75 184.47,12.7 179.07,12.7 179.07,17.46 v171.77,24.77
  Bottom 0.203: 20.32,37.47 2.54,37.47 D10.C | 20.32,37.47 39.37,37.47 | 20.32,37.47 D11.C | 39.37,37.47 58.42,37.47 | 39.37,37.47 D12.C | 58.42,37.47 77.47,37.47 | 58.42,37.47 D13.C | 77.47,37.47 96.52,37.47 D26.C 96.52,37.15 111.76,37.15 113.98,34.92 115.57,34.92 | 77.47,37.47 D25.C | D44.C 226.06,25.72 225.43,25.72 224.79,25.08 214.31,25.08 214.24,25.01 | v189.87,30.8 189.87,32.38 U1.29 | 171.45,25.08 160.66,25.08 160.02,25.72 153.67,25.72 D41.C 153.67,26.04 150.5,26.04 144.78,31.75 144.15,31.75 138.75,37.15 134.62,37.15 | 171.45,25.08 172.09,25.72 172.72,25.72 D42.C | 115.57,34.92 123.83,34.92 126.05,37.15 134.62,37.15 | 134.62,37.15 D28.C | 171.45,25.08 v171.77,24.77 | 115.57,34.92 D27.C | v196.53,19.05 201.29,23.81 205.74,23.81 205.79,23.86 213.09,23.86 214.24,25.01 | D43.C 210.82,29.63 214.24,26.21 214.24,25.01
ROW3
  Bottom 0.203: 140.34,18.41 132.08,18.41 D32.C 131.74,18.31 128.89,15.46 | 153.67,18.41 147.64,18.41 146.37,19.68 142.24,19.68 140.97,18.41 140.34,18.41 | 140.34,18.41 D51.C | 153.67,18.41 172.72,18.41 | 153.67,18.41 D45.C | 187.01,22.54 191.13,18.41 191.77,18.41 D47.C 191.77,18.1 192.41,18.1 193.99,16.51 204.7,16.51 207.26,13.95 212.1,13.95 216.15,18 216.15,18.1 226.06,18.1 D48.C | 187.01,22.54 187.01,30.16 187.96,30.16 188.91,31.11 188.91,32.38 U1.30 | 172.72,18.41 182.88,18.41 187.01,22.54 | 172.72,18.41 D46.C | 77.47,18.41 80.96,18.41 82.23,19.68 86.36,19.68 87.63,18.41 88.27,18.41 | 88.27,18.41 93.98,18.41 | 88.27,18.41 D49.C | 93.98,18.41 94.61,18.41 99.28,23.07 D50.C 105.62,23.07 108.15,20.55 108.92,20.55 112.28,23.92 122.53,23.92 128.86,17.59 128.86,15.49 128.89,15.46 | 93.98,18.41 D30.C | 39.37,12.7 41.27,12.7 46.67,18.1 58.42,18.1 D19.C 58.42,18.41 77.47,18.41 | 39.37,12.7 38.73,12.7 34.92,16.51 29.84,16.51 26.91,13.57 D17.C 16.37,13.57 16.35,13.55 11.59,18.31 D16.C | 39.37,12.7 D18.C | 77.47,18.41 D29.C | D31.C 120.61,13.89 127.32,13.89 128.89,15.46
UCAP  (via drill 0.35)
  Top 0.203: v184.47,43.5 186.37,45.4 v190.18,45.4
  Bottom 0.203: v184.47,43.5 C6.2 | v190.18,45.4 190.5,45.09 U1.6
VCC  (via drill 0.35)
  Top 0.203: v188.59,39.05 189.55,39.05 193.68,34.92 v193.68,33.97 | v49.53,55.56 48.58,55.56 37.47,66.67 v36.51,66.67
  Bottom 0.203: C2.1 C1.1 | C2.1 208.6,52 208,52 207.91,52.09 | C2.1 | C5.1 C4.1 205,59.61 205,55 207.91,52.09 | C5.1 R5.2 | C5.1 | 187.32,42.23 187.32,43.5 U1.2 | U1.34 185.1,33.97 186.06,33.97 187.32,35.24 187.32,39.05 v188.59,39.05 188.59,40.32 | 188.59,40.32 188.28,40.32 188.28,42.23 187.32,42.23 | 188.59,40.32 192.41,40.32 192.72,40.64 193.04,40.64 | U1.7 191.45,43.5 191.45,42.23 193.04,40.64 | v193.68,33.97 193.68,32.7 U1.24 | 193.04,40.64 195.9,40.64 U1.14 196.22,40.64 204.79,40.64 206.69,42.55 206.69,43.81 207.01,44.13 208.6,44.13 C1.1 | C1.1 | v36.51,66.67 36.51,68.9 J1.1 | v49.53,55.56 50.48,54.61 92.71,54.61 104.62,42.7 120.49,42.7 120.97,42.23 175.26,42.23 177.16,40.32 181.61,40.32 183.51,42.23 184.78,42.23 U1.44 185.1,42.23 187.32,42.23 | 207.91,52.09 C3.1